# Altium schematic sheet BLE_Schematic.SchDoc
size A4; SheetNumber: 1; SheetTotal: 1
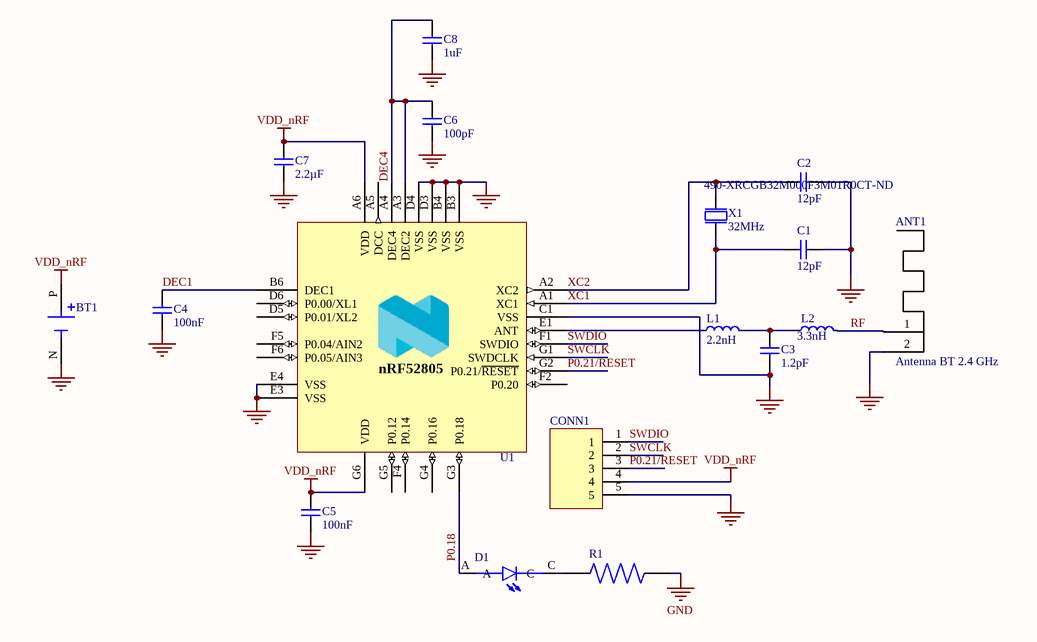
[diagram p0: BLE_Schematic.SchDoc]

## Parts
ANT1  Antenna BT 2.4 GHz  [Atenna_BT]
BT1  Holder CR2477  [BAT_122-3124-GR]  (value not drawn)
C1  12pF  [CAPC0603X03L_C]
C2  12pF  [CAPC0603X03L_C]
C3  1.2pF  [CAPC0603X03L_C]
C4  100nF  [CAPC0603X03L_C]
C5  100nF  [CAPC0603X03L_C]
C6  100pF  [CAPC0603X03L_C]
C7  2.2µF  [CAPC1005X04L]
C8  1uF  [CAPC1005X04L]
CONN1  Connector  [1x5x2.54 Pin Header TH V]  (value not drawn)
D1  LED  [LEDC1608X35N]  (value not drawn)
L1  2.2nH  [INDC0603X03L_C]
L2  3.3nH  [INDC0603X03L_C]
R1  RMCF0402FT220R  [RESC1005X35N]  (value not drawn)
U1  (no value)  [BGA28C40P6X6_247X246X50]
X1  32MHz  Supplier Part Number 1: 490-XRCGB32M000F3M01R0CT-ND  [BT-XTAL_2016]

## Nets
GND: ANT1.2 BT1.N(NEG) C1.2 C2.2 C3.1 C4.1 C5.1 C6.1 C7.1 C8.1 CONN1.5 R1.2 U1.B3(VSS) U1.B4(VSS) U1.C1(VSS) U1.D3(VSS) U1.D4(VSS) U1.E3(VSS) U1.E4(VSS) X1.2(GND) X1.4(GND)
VDD_nRF: BT1.P(POS) C5.2 C7.2 CONN1.4 U1.A6(VDD) U1.G6(VDD)
DEC1: C4.2 U1.B6(DEC1)
DEC4: C6.2 C8.2 U1.A3(DEC2) U1.A4(DEC4)
P0.18: D1.A U1.G3(P0.18)
P0.21/RESET: CONN1.3 U1.G2(P0.21/~{RESET})
RF: ANT1.1 L2.2
SWCLK: CONN1.2 U1.G1(SWDCLK)
SWDIO: CONN1.1 U1.F1(SWDIO)
XC1: C1.1 U1.A1(XC1) X1.1(inp)
XC2: C2.1 U1.A2(XC2) X1.3(out)
NetC3_2: C3.2 L1.2 L2.1
NetD1_C: D1.C R1.1
NetL1_1: L1.1 U1.E1(ANT)

Not connected (* = marked no-connect by the designer): U1 A5(DCC) D5(P0.01/XL2) D6(P0.00/XL1) F2(P0.20) F4(P0.14) F5(P0.04/AIN2) F6(P0.05/AIN3) G4(P0.16) G5(P0.12)

## Notes on the sheet
- (in symbol nRF52805_CAAA) nRF52805

## Library data of the parts
ANT1 = Antenna_BT: Antenna BT 2.4 GHz / 50 Ohms impedance
BT1 = 122-3124-GR: Coin Cell Battery Holders CR2477 COIN CELL HL; MF: Eagle Plastic Devices; Package: None; Price: None; Value: *; SnapEDA_Link: https://www.snapeda.com/parts/122-3124-GR/Eagle+Plastic+Devices/view-part/?ref=snap; MP: 122-3124-GR; Availability: In Stock; Check_prices: https://www.snapeda.com/parts/122-3124-GR/Eagle+Plastic+Devices/view-part/?ref=eda
C1 C2 = CAP_0201: Capacitor, NP0, ±2%; Part Number: C0201-12p; Manufacturer: *; Manufacturer Part Number: *; LatestRevisionDate: 2017-11-09; Pin Count: 2; Publisher: Nordic Semiconductor; Published: 2014-11-13; Value: 12pF; Footprint Doc: 0201; Supplier 1: Digi-Key; Supplier Part Number 1: 490-11308-1-ND
C3-C6 = CAP_0201: Capacitor, NP0, ±2%; Part Number: C0201-12p; Value: 12pF; Manufacturer: *; Manufacturer Part Number: *; LatestRevisionDate: 2017-11-09; Pin Count: 2; Publisher: Nordic Semiconductor; Published: 2014-11-13; Footprint Doc: 0201; Supplier 1: Digi-Key
  C3: Supplier Part Number 1: 490-GJM1555C1H1R2JB01DCT-ND
  C4 C5: Supplier Part Number 1: 478-KGM03AR70J104KHCT-ND
  C6: Supplier Part Number 1: 490-7751-1-ND
C7 = CAP_0402: Capacitor, X5R, ±20%; Part Number: C0402-2µ2; Manufacturer: *; Manufacturer Part Number: *; LatestRevisionDate: 2006-06-02; Pin Count: 2; Publisher: Nordic Semiconductor; Published: 2009-05-08; Value: 2.2µF; Footprint Doc: 0402; Supplier 1: Digi-Key; Supplier Part Number 1: 490-GRM155D71C225ME11DCT-ND
C8 = CAP_0402: Capacitor, X5R, ±20%; Part Number: C0402-2µ2; Value: 2.2µF; Manufacturer: *; Manufacturer Part Number: *; LatestRevisionDate: 2006-06-02; Pin Count: 2; Publisher: Nordic Semiconductor; Published: 2009-05-08; Footprint Doc: 0402; Supplier 1: Digi-Key; Supplier Part Number 1: 478-CM05X5R105M10AHCT-ND
CONN1 = Header 1x5
D1 = LED: Red 631nm LED Indication - Discrete 2V 0603 (1608 Metric); MF: Lite-On Inc.; MP: LTST-C190KRKT; Check_prices: https://www.snapeda.com/parts/LTST-C190KRKT/Lite-On+Inc./view-part/?ref=eda; Value: *; Purchase-URL: https://pricing.snapeda.com/search/part/LTST-C190KRKT/?ref=eda; Price: None; SnapEDA_Link: https://www.snapeda.com/parts/LTST-C190KRKT/Lite-On+Inc./view-part/?ref=snap; Availability: In Stock; Package: 0603 Lite-On; Supplier 1: Arrow Electronics; Supplier Part Number 1: LTST-C190KRKT
L1 = IND_0201: High frequency chip inductor ±5%; Part Number: L0201-2n2; Manufacturer: *; Manufacturer Part Number: *; LatestRevisionDate: 2013-04-10; Pin Count: 2; Publisher: Nordic Semiconductor; Published: 2013-04-10; Value: 2.2nH; Footprint Doc: 0201; Supplier 1: Digi-Key; Supplier Part Number 1: 445-16280-1-ND
L2 = IND_0201: High frequency chip inductor ±5%; Part Number: L0201-2n2; Value: 2.2nH; Manufacturer: *; Manufacturer Part Number: *; LatestRevisionDate: 2013-04-10; Pin Count: 2; Publisher: Nordic Semiconductor; Published: 2013-04-10; Footprint Doc: 0201; Supplier 1: Digi-Key; Supplier Part Number 1: 2035-0402HS-3N3EJTSCT-ND
R1 = RMCF0402FT220R: Res Thick Film 0402 220 Ohm 1% 0.063W(1/16W) ±100ppm/C Pad SMD T/R; Manufacturer: Walsin Technologies; Manufacturer Part Number: WR04X2200FTL; Resistance: 220R; Voltage Rating: 50V; Power Rating: 62.5mW; Temperature Coefficient: 100ppm/°C; Package: None; Price: None; Value: *; MP: RMCF0402FT220R; Availability: Unavailable; Supplier 1: Digi-Key; RoHS: Yes; Category: Chip SMD Resistors; Stock 1: 49048; Pricing 1: 1=0.1, 10=0.01, 50=0.0034, 100=0.0024, 500=0.0015, 1000=0.0011, 5000=0.00079 (USD); Case/Package: Molded; Case Code (Metric): 1005; Case Code (Imperial): 0402; Contact Material: Tin; Min Operating Temperature: -55°C; Max Operating Temperature: 155°C; Packaging: Tape and Reel; Tolerance: 1%; Resistor Type: Thick Film; Voltage Rating (DC): 50V; Resistance Tolerance: 1%; Construction: Rectangular; Length: 1mm; Depth: 0.5mm; Military Standard: Not; Lead Free: Lead Free; RoHS Compliant: Yes; Reach SVHC Compliant: Unknown; ComponentLink1URL: https://datasheet.ciiva.com/26865/getdatasheetpartid-414190-26865262.pdf?src-supplier=Verical; ComponentLink1Description: https://datasheet.ciiva.com/26865/getdatasheetpartid-414190-26865262.pdf?src-supplier=Verical; Supplier Part Number 1: 1292-WR04X2200FTLCT-ND
U1 = nRF52805_CAAA: Multi-protocol Bluetooth Low Energy, IEEE 802.15.4, ANT and 2.4GHz proprietary system-on-chip; Part Number: nRF52805-CAAA; Manufacturer: Nordic Semiconductor; Value: nRF52805-CAAA; Manufacturer Part Number: nRF52805-CAAA; LatestRevisionDate: 2018-11-28; Pin Count: 28; Publisher: Nordic Semiconductor; Published: 2018-11-28; Footprint Doc: WLCSP-28; Supplier 1: Digi-Key; Supplier Part Number 1: 4823-NRF52805-CAAA-B-R7CT-ND
X1 = XTAL_SMD2016: XTAL SMD 2016, 32MHz, Cl=8pF, Total Tol: ±40ppm; Part Number: XTAL_SMD2016_32MHz_8pF_General; Manufacturer: *; Manufacturer Part Number: *; LatestRevisionDate: 2016-08-19; Pin Count: 4; Publisher: Nordic Semiconductor; Published: 2016-08-19; Value: 32MHz; Footprint Doc: XTAL_2016; Supplier 1: Digi-Key